# EAGLE design DC_STEP_DRIVER (EAGLE 6.6.0)
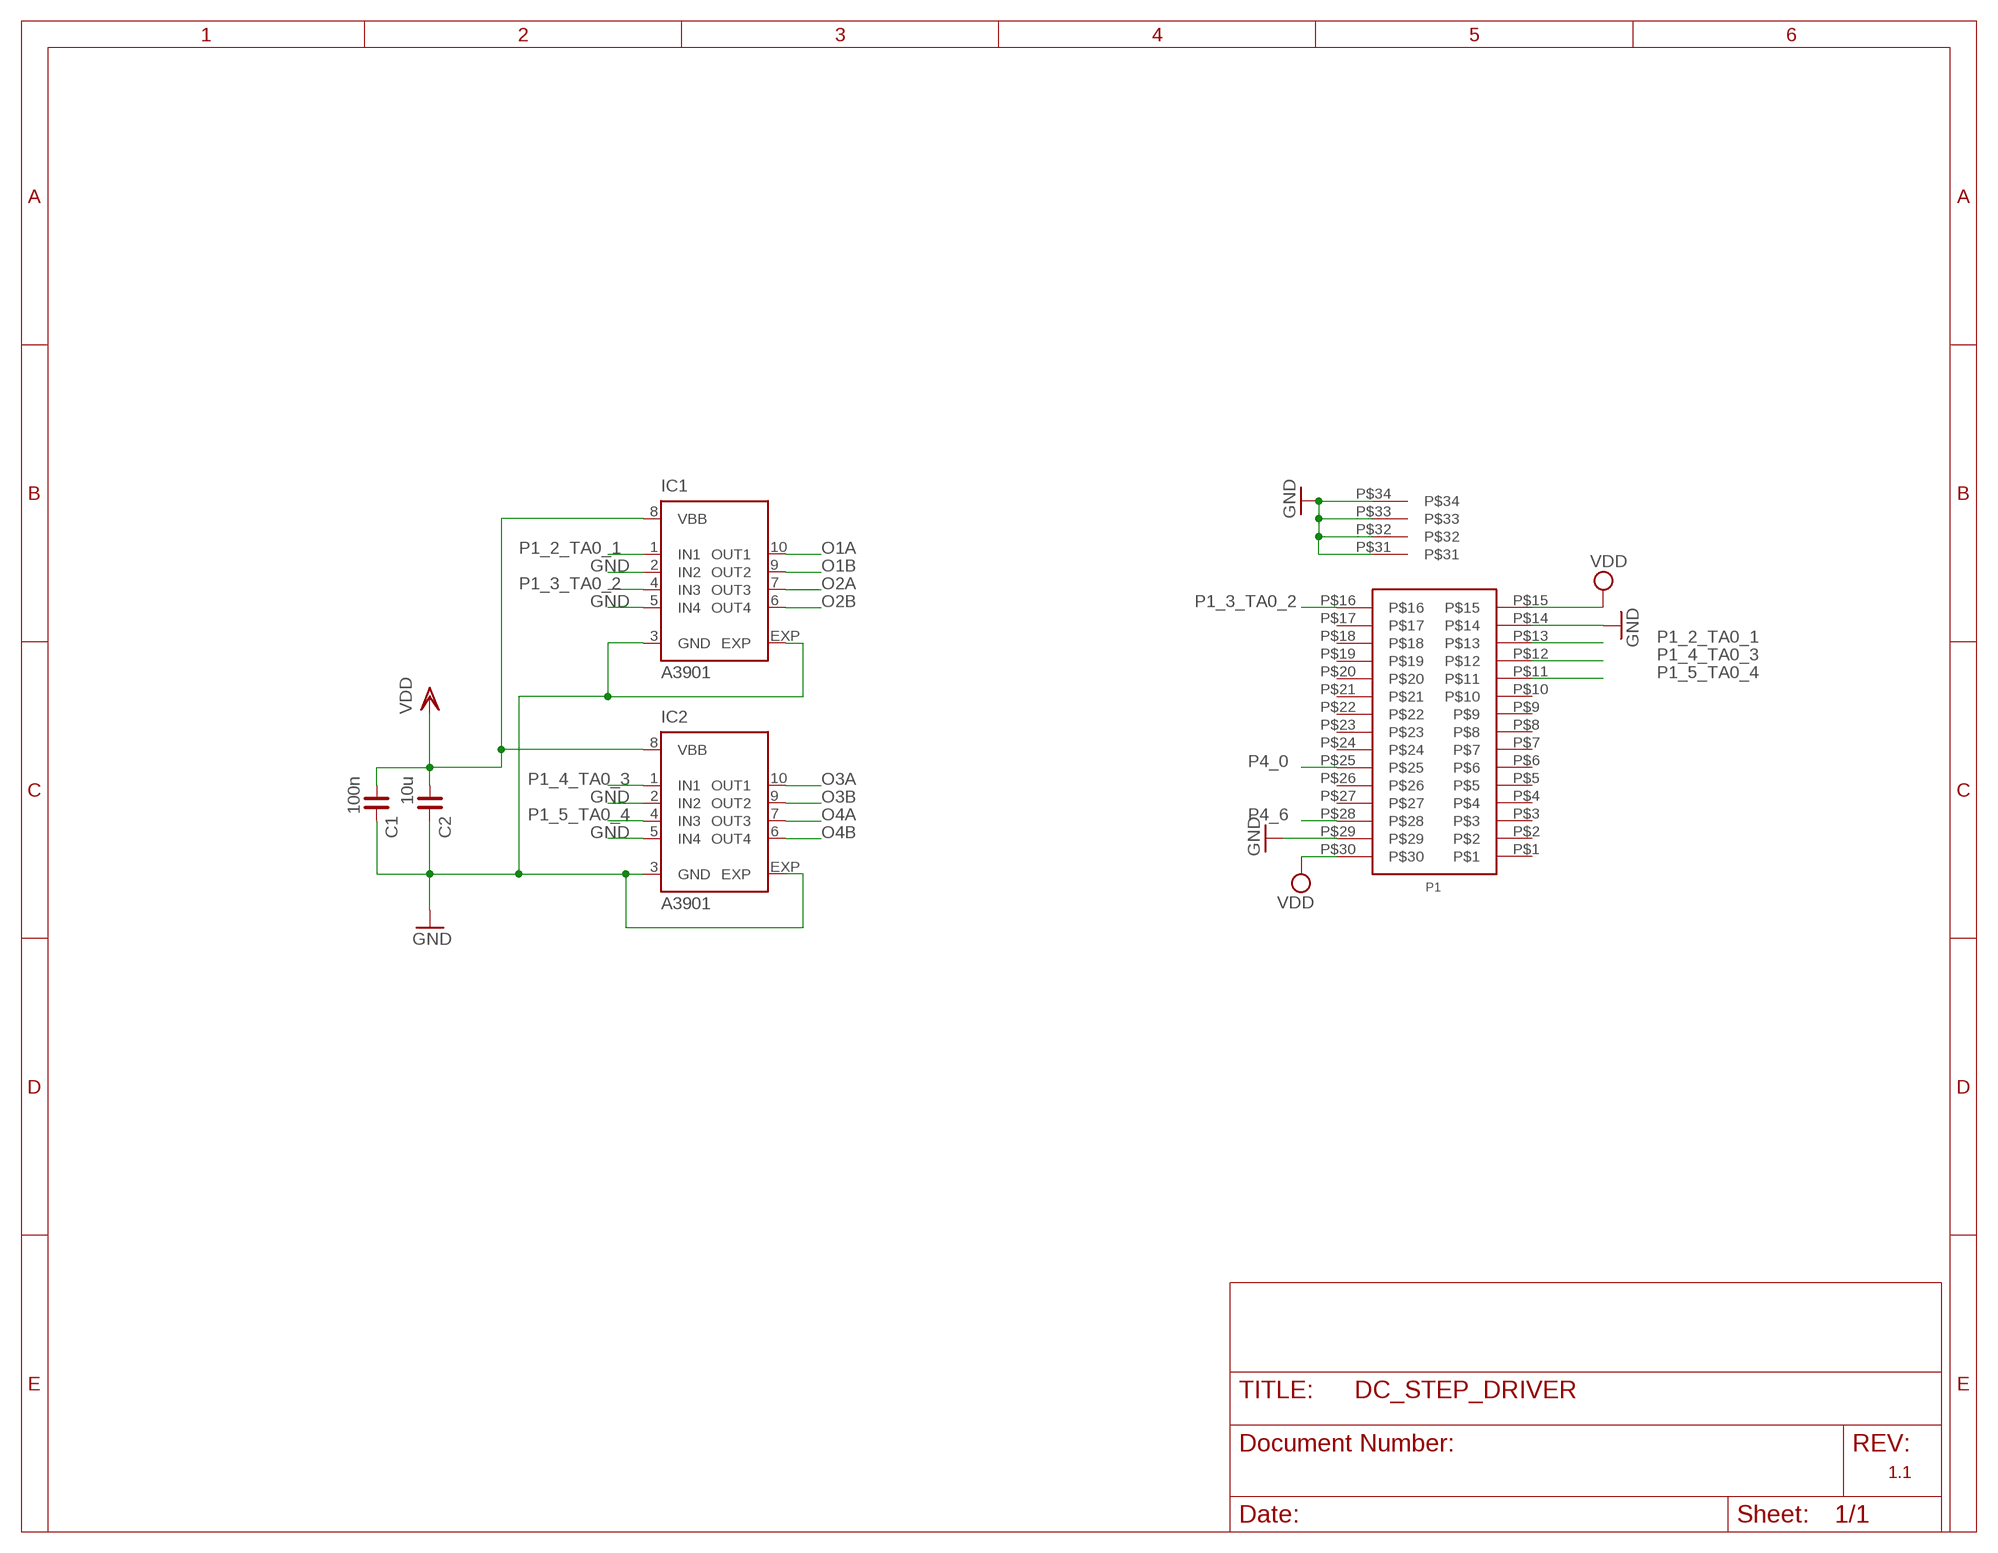
[diagram p0: schematic, sheet 1]

## Parts
C1  100n  C_0402  [C0402]
C2  10u  C_0402  [C0402]
IC1  A3901  [DFN10-3X3]
IC2  A3901  [DFN10-3X3]
P1  55909-0374  55909-0374_PLUG  [55909-0374_PLUG]

## Nets
GND: C1.2 C2.2 IC1.2(IN2) IC1.3(GND) IC1.5(IN4) IC1.EXP IC2.2(IN2) IC2.3(GND) IC2.5(IN4) IC2.EXP P1.P$14 P1.P$29 P1.P$31 P1.P$32 P1.P$33 P1.P$34
O1A: IC1.10(OUT1)
O1B: IC1.9(OUT2)
O2A: IC1.7(OUT3)
O2B: IC1.6(OUT4)
O3A: IC2.10(OUT1)
O3B: IC2.9(OUT2)
O4A: IC2.7(OUT3)
O4B: IC2.6(OUT4)
P1_2_TA0_1: IC1.1(IN1) P1.P$13
P1_3_TA0_2: IC1.4(IN3) P1.P$16
P1_4_TA0_3: IC2.1(IN1) P1.P$12
P1_5_TA0_4: IC2.4(IN3) P1.P$11
P4_0: P1.P$25
P4_6: P1.P$28
VDD: C1.1 C2.1 IC1.8(VBB) IC2.8(VBB) P1.P$15 P1.P$30
Unconnected: P1.P$1 P1.P$2 P1.P$3 P1.P$4 P1.P$5 P1.P$6 P1.P$7 P1.P$8 P1.P$9 P1.P$10 P1.P$17 P1.P$18 P1.P$19 P1.P$20 P1.P$21 P1.P$22 P1.P$23 P1.P$24 P1.P$26 P1.P$27

## Notes on the sheet
- 1.1

## Library data of the parts
C1 C2 = rc-master-smd:C_: NON-POLARIZED CAP
IC1 IC2 = Allegro:A3901: Dual Full Bridge Low Voltage Motor Driver Source: www.allegromicro.com .. 3901.pdf; MPN: A3901SEJTR-T; OC_FARNELL: 1651947; OC_NEWARK: 87K3379
P1 = Molex_SlimStack:55909-0374_PLUG: 55909-0374_PLUG MOLEX; VENDOR: DK

## Board
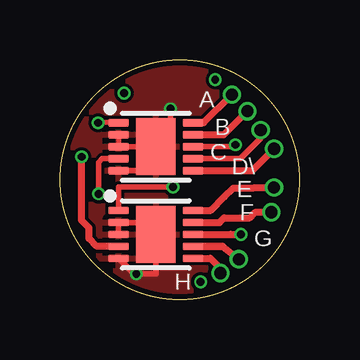
[diagram p1: board, top side]
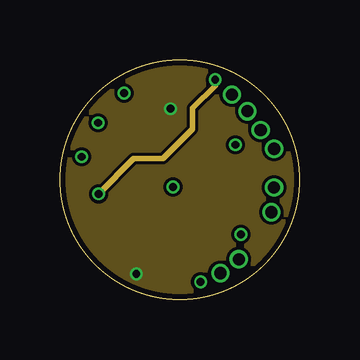
[diagram p2: board, inner layer Route2]
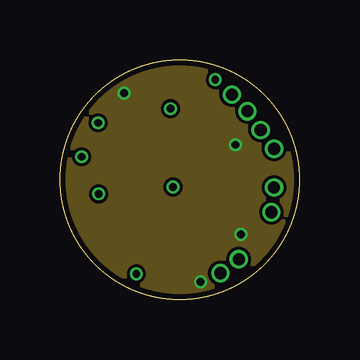
[diagram p3: board, inner layer Route15]
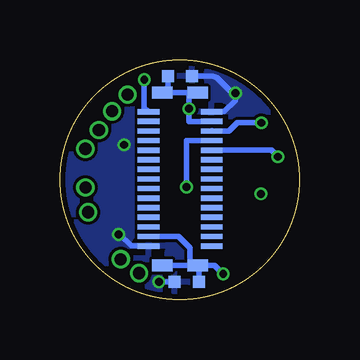
[diagram p4: board, bottom side, seen from below]

Size 10 x 10 mm. Coordinates in mm from the lower left corner, seen from the top.
Outline: circle at 5,5 radius 5
Copper layers (1+2*15+16): Top 0.0356mm / dielectric 0.1702mm / Route2 0.0178mm / dielectric 47mil / Route15 0.0178mm / dielectric 0.1702mm / Bottom 0.0356mm
Design rules "LaenPCBOrder - 4 layers *": minimum track width 5mil, minimum drill 10mil, track to track 5mil, track to pad 5mil, pad to pad 5mil, via to via 5mil, smd to smd 5mil, copper to edge 10mil, drill to drill 5mil, minimum pad ring 4mil, minimum via ring 4mil, stop-mask expansion 3mil, vias tented up to drill 15mil, thermal gap 10mil

### Footprints (pad centres in the part's own frame; a part is rotated, then mirrored left to right if it is on the bottom)
C0402 = smd 0.5 x 0.5: 1 -0.508,0; 2 0.508,0
DFN10-3X3 = smd 0.3 x 0.85: 1 -1,-1.55; 2 -0.5,-1.55; 3 0,-1.55; 4 0.5,-1.55; 5 1,-1.55; 6 1,1.55; 7 0.5,1.55; 8 0,1.55; 9 -0.5,1.55; 10 -1,1.55 | smd 2.38 x 1.65: EXP 0,0
55909-0374_PLUG = smd 0.9 x 0.22: P$1 -1.315,2.8; P$2 -1.315,2.4; P$3 -1.315,2; P$4 -1.315,1.6; P$5 -1.315,1.2; P$6 -1.315,0.8; P$7 -1.315,0.4; P$8 -1.315,0; P$9 -1.315,-0.4; P$10 -1.315,-0.8; P$11 -1.315,-1.2; P$12 -1.315,-1.6; P$13 -1.315,-2; P$14 -1.315,-2.4; P$15 -1.315,-2.8; P$16 1.315,-2.8; P$17 1.315,-2.4; P$18 1.315,-2; P$19 1.315,-1.6; P$20 1.315,-1.2; P$21 1.315,-0.8; P$22 1.315,-0.4; P$23 1.315,0; P$24 1.315,0.4; P$25 1.315,0.8; P$26 1.315,1.2; P$27 1.315,1.6; P$28 1.315,2; P$29 1.315,2.4; P$30 1.315,2.8 | smd 0.85 x 0.5: P$31 -0.74,-3.6; P$32 0.74,-3.6; P$33 -0.74,3.6; P$34 0.74,3.6

### Placement (x,y rotation side)
C1  4.71,0.74 0 bottom
C2  4.99,9.33 180 bottom
IC1  4,6.38 270 top
IC2  4,2.72 270 top
P1  4.99,5.03 180 bottom

### Tracks (layer width: path | path; a pad name or v marks a point on that pad's centre or on a via)
GND  (via drill 0.33)
  Top 0.2: IC1.EXP IC1.3 IC1.2 | IC2.EXP 3.42,3.22 IC2.2 IC2.3
  Top 0.22: IC2.5 3.1,1.07 v3.19,1.07 4,1.07 IC2.EXP | IC1.5 4,5.38 IC1.EXP 4.62,6.38 v4.62,7.96
  Bottom 0.152: P1.P$33 4.42,1.43 | P1.P$29
  Bottom 0.22: P1.P$33 4.56,1.43 4.56,2.15 5.05,2.63 P1.P$29 | v3.19,1.07 3.55,1.43 P1.P$33 | C2.2 5.49,8.87 P1.P$32 P1.P$31 4.62,8.63 v4.62,7.96 4.62,7.43 P1.P$14 | 4.5,1.35 4.2,1.35 C1.2 | P1.P$34 P1.P$33
  Bottom 0.3: 4.42,1.43 4.5,1.35
  pour Top: 0,5.01 arc-90 5,10.01 arc-90 10,5.01 arc-90 5,0.01 arc-91
  pour Route2: 0,5.01 arc-90 5,10.01 arc-90 10.01,5.01 arc-90 5.01,0.01 arc-91
O1A  (via drill 0.51)
  Top 0.22: 5.69,7.38 IC1.10
  Top 0.3: 5.69,7.38 6,7.38 v7.17,8.56
O1B  (via drill 0.51)
  Top 0.3: IC1.9 6.84,6.88 v7.83,7.86
O2A  (via drill 0.51)
  Top 0.22: IC1.7 7.53,5.88 7.88,6.23 8.37,6.72 v8.37,7.07
O2B  (via drill 0.51)
  Top 0.3: IC1.6 7.75,5.38 8.02,5.38 v8.94,6.29
O3A  (via drill 0.51)
  Top 0.3: v8.93,4.67 8.91,4.65 8.07,4.65 7.23,4.65 6.88,4.29 6.3,3.72 6.26,3.72 IC2.10 | IC2.10 arc-90 IC2.10
O3B  (via drill 0.51)
  Top 0.22: 5.47,3.22 IC2.9
  Top 0.3: 5.47,3.22 6.66,3.22 6.85,3.41 7.93,3.41 8.16,3.65 v8.82,3.65
O4A  (via drill 0.51)
  Top 0.305: IC2.7 6.79,2.22 v7.46,1.68
O4B  (via drill 0.51)
  Top 0.3: IC2.6 6.28,1.72 6.41,1.59 6.64,1.36 v6.7,1.11
P1_2_TA0_1  (via drill 0.33)
  Top 0.2: IC1.1 1.66,7.38 v1.59,7.38
  Bottom 0.2: 3.66,7.05 P1.P$13
  Bottom 0.22: 3.66,7.05 3.64,7.03 2.94,7.03 2.6,7.38 v1.59,7.38
P1_3_TA0_2  (via drill 0.33)
  Top 0.22: IC1.4 2.44,5.88 1.77,5.88 1.61,5.72 v1.61,4.41
  Route2 0.22: v1.61,4.41 3.08,5.89 4.31,5.89 5.54,7.11 5.54,7.99 6.48,8.93 v6.48,9.17
  Bottom 0.22: P1.P$16 6.48,8.01 6.48,8.62 6.48,9.22 v6.48,9.17
P1_4_TA0_3  (via drill 0.33)
  Top 0.22: v4.72,4.69 2.45,4.69 IC2.1
  Bottom 0.152: P1.P$12
  Bottom 0.22: 3.69,6.63 P1.P$12 4.72,6.64 v4.72,4.69 | 4.52,6.63 P1.P$12
P1_5_TA0_4  (via drill 0.33)
  Top 0.152: 2.44,2.23 IC2.4
  Top 0.3: 2.44,2.23 2.42,2.22 1.53,2.22 1.21,2.54 1.21,3 0.9,3.3 v0.9,5.96
  Bottom 0.152: P1.P$11
  Bottom 0.22: P1.P$11 2.45,6.24 1.18,6.24 v0.9,5.96
VDD  (via drill 0.33)
  Top 0.22: IC1.8 7.24,6.38 v7.32,6.46
  Top 0.3: IC2.8 7.12,2.72 v7.55,2.72 | IC1.8
  Top 0.305: 5.47,6.38 IC1.8
  Bottom 0.22: P1.P$30 7.02,2.23 7.5,2.72 v7.55,2.72 | P1.P$15 3.15,7.83 2.68,8.3 v2.68,8.62 2.81,8.62 3.15,8.96 3.44,9.25 3.64,9.32 C2.1 4.35,9.31 | C1.1 v5.88,0.74 v5.87,0.74
  pour Bottom: 0,5.01 arc-90 5,10.01 arc-90 10,5.02 arc-90 5,0.02 arc-91
  pour Route15: 0,5.01 arc-90 5,10.01 arc-90 10.01,5.02 arc-90 5.01,0.02 arc-91

### Text on the board
tPlace: A | B | C | D\ | E | F | G | H